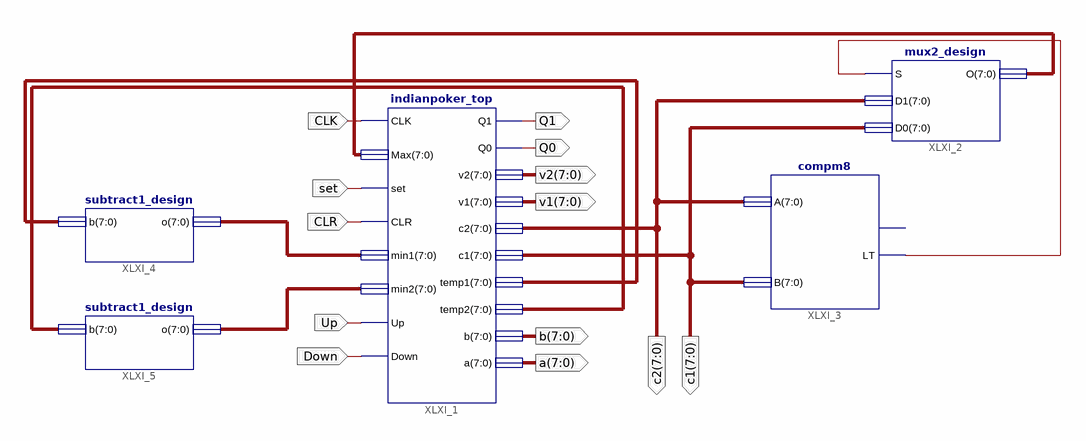
[diagram p0: schematic sheet 1]
// Xilinx ISE schematic indiapoker_top_top.sch (spartan3) as structural Verilog: 5 symbols, 13 ports
module indiapoker_top_top (
  input  set,
  input  CLR,
  input  Up,
  input  Down,
  input  CLK,
  output [7:0] c2,
  output [7:0] c1,
  output [7:0] v1,
  output [7:0] v2,
  output Q0,
  output Q1,
  output [7:0] b,
  output [7:0] a
);

  wire XLXN_27;
  wire [7:0] XLXN_5, XLXN_6, XLXN_7, XLXN_8, XLXN_9;

  indianpoker_top XLXI_1 (
    .CLK(CLK), .Max(XLXN_5), .set(set), .CLR(CLR), .min1(XLXN_9), .min2(XLXN_8), .Up(Up), .Down(Down),
    .Q1(Q1), .Q0(Q0), .v2(v2), .v1(v1), .c2(c2), .c1(c1), .temp1(XLXN_6), .temp2(XLXN_7), .b(b), .a(a));
  subtract1_design XLXI_4 (.b(XLXN_6), .o(XLXN_9));
  subtract1_design XLXI_5 (.b(XLXN_7), .o(XLXN_8));
  mux2_design XLXI_2 (.S(XLXN_27), .D1(c2), .D0(c1), .O(XLXN_5));
  compm8 XLXI_3 (.A(c2), .B(c1), .LT(XLXN_27));  // open: GT
endmodule
